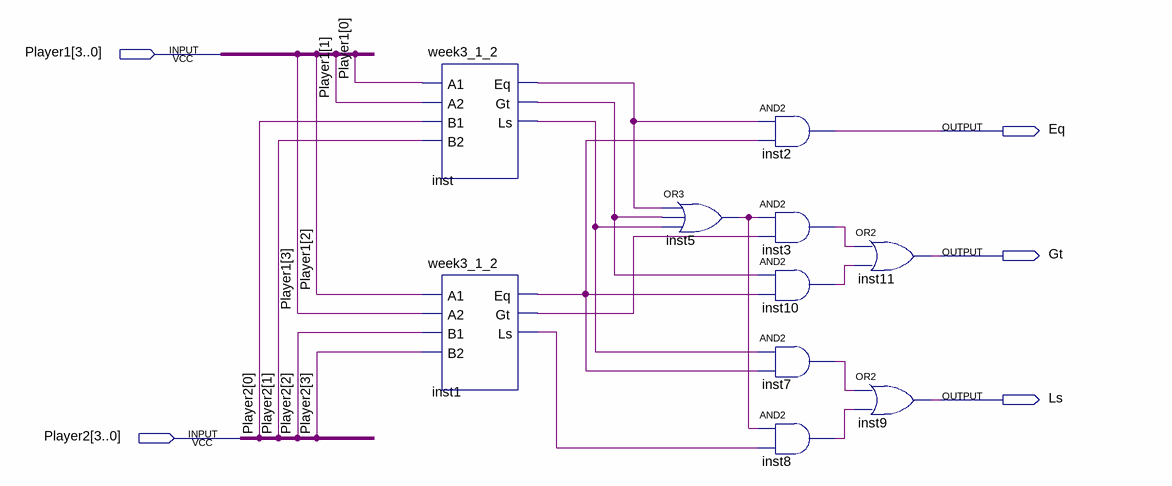
[diagram p0: schematic sheet]
// Quartus schematic week3_3.bdf as structural Verilog: 10 symbols, 5 pins
module week3_3 (
  input  [3:0] Player1,
  input  [3:0] Player2,
  output Eq,
  output Gt,
  output Ls
);

  wire inst1_eq, inst1_gt, inst1_ls, inst3_out, inst5_out, inst7_out, inst8_out, inst10_out, inst_eq,
       inst_gt, inst_ls;

  week3_1_2 inst (
    .A1(Player1[0]), .A2(Player1[1]), .B1(Player2[0]), .B2(Player2[1]), .Eq(inst_eq), .Gt(inst_gt),
    .Ls(inst_ls));
  week3_1_2 inst1 (
    .A1(Player1[2]), .A2(Player1[3]), .B1(Player2[2]), .B2(Player2[3]), .Eq(inst1_eq), .Gt(inst1_gt),
    .Ls(inst1_ls));
  or inst5 (inst5_out, inst_eq, inst_gt, inst_ls);
  and inst2 (Eq, inst_eq, inst1_eq);
  and inst3 (inst3_out, inst5_out, inst1_gt);
  and inst10 (inst10_out, inst_gt, inst1_eq);
  and inst7 (inst7_out, inst_ls, inst1_eq);
  and inst8 (inst8_out, inst5_out, inst1_ls);
  or inst11 (Gt, inst3_out, inst10_out);
  or inst9 (Ls, inst7_out, inst8_out);
endmodule
